# Altium schematic sheet LCD.SchDoc
size A; DocumentNumber: 7; SheetNumber: 6; SheetTotal: 9
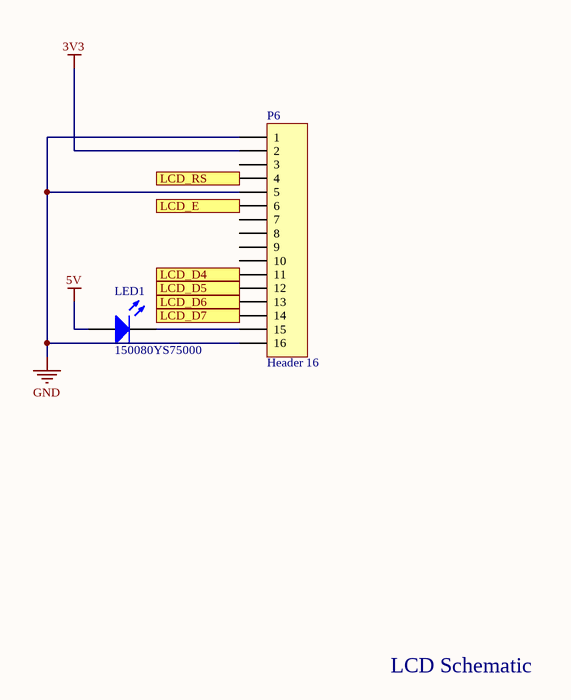
[diagram p0: LCD.SchDoc]

## Parts
LED1  150080YS75000  [0805_A]
P6  Header 16  [HDR1X16]

## Ports
LCD_D4 (in), LCD_D5 (in), LCD_D6 (in), LCD_D7 (in), LCD_E (in), LCD_RS (in)

## Nets
3V3: P6.2
5V: LED1.2(A)
GND: P6.1 P6.5 P6.16
LCD_D4: P6.11 ; port LCD_D4
LCD_D5: P6.12 ; port LCD_D5
LCD_D6: P6.13 ; port LCD_D6
LCD_D7: P6.14 ; port LCD_D7
LCD_E: P6.6 ; port LCD_E
LCD_RS: P6.4 ; port LCD_RS
NetLED1_1: LED1.1(K) P6.15

Not connected (* = marked no-connect by the designer): P6 3 7 8 9 10

## Notes on the sheet
- LCD Schematic

## Library data of the parts
LED1 = CMP-1426-00012-1: SMD mono-color Chip LED, WL-SMCW, Yellow; Manufacturer: Wuerth Elektronik; Color: Yellow; ComponentLink1URL: http://www.we-online.com; PackageReference: 0805_A; ComponentLink2URL: http://katalog.we-online.com/led/datasheet/150080YS75000.pdf; ComponentLink1Description: Manufacturer URL; ComponentLink2Description: Datasheet; PartNumber: 150080YS75000
P6 = Header 16: Header, 16-Pin; LatestRevisionDate: 17-Jul-2002; LatestRevisionNote: Re-released for DXP Platform.; Publisher: Altium Limited